# Altium schematic sheet Kick_Sheet.SchDoc
size A4; System: Connector
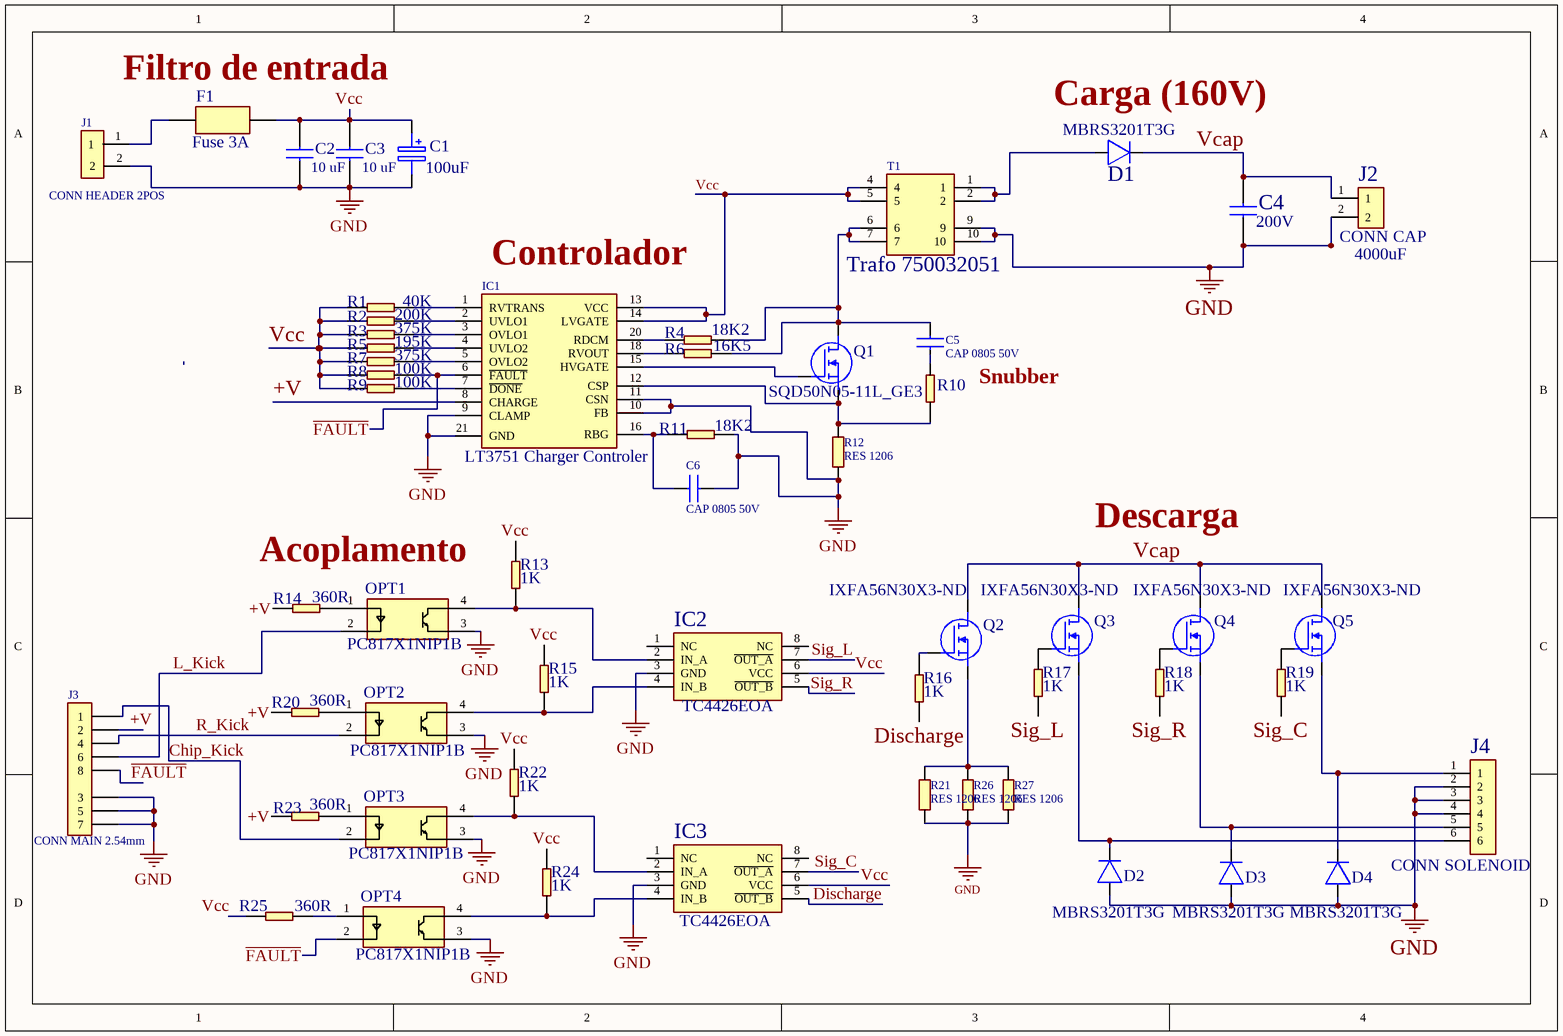
[diagram p0: Kick_Sheet.SchDoc]

## Parts
C1  100uF  [CAPAE830X1050N]
C2  10 uF  [CAPCER1206]
C3  10 uF  [CAPCER1206]
C4  200V  [CAP OUT 2225]
C5  CAP 0805 50V  [CAP0805 50v]
C6  CAP 0805 50V  [CAP0805 50v]
D1  MBRS3201T3G  [DIODE MBRS3201T]
D2  MBRS3201T3G  [DIODE MBRS3201T]
D3  MBRS3201T3G  [DIODE MBRS3201T]
D4  MBRS3201T3G  [DIODE MBRS3201T]
F1  Fuse 3A  [Fuse 3A 63V]
IC1  LT3751 Charger Controler  [LT3751 Charger Controler]
IC2  TC4426EOA  [SOIC127_TC4426]
IC3  TC4426EOA  [SOIC127_TC4426]
J1  CONN HEADER 2POS  [Battery Reto Connector]
J2  CONN CAP  Capacitancia: 4000uF  [CONN CAP]
J3  CONN MAIN 2.54mm  [CONN MAIN 2.54mm]
J4  CONN SOLENOID  [CONN SOLENOID]
OPT1  PC817X1NIP1B  [SOP254_Opto_PC817]
OPT2  PC817X1NIP1B  [SOP254_Opto_PC817]
OPT3  PC817X1NIP1B  [SOP254_Opto_PC817]
OPT4  PC817X1NIP1B  [SOP254_Opto_PC817]
Q1  Manufacturer_Part_Number: SQD50N05-11L_GE3  [Mosfet Chaveamento]  (hidden comment: Mosfet N 50V 50A)
Q2  Manufacturer_Part_Number: IXFA56N30X3-ND  [Mosfet Disparo 2]  (hidden comment: Mosfet N Disparo)
Q3  Manufacturer_Part_Number: IXFA56N30X3-ND  [Mosfet Disparo 2]  (hidden comment: Mosfet N Disparo)
Q4  Manufacturer_Part_Number: IXFA56N30X3-ND  [Mosfet Disparo 2]  (hidden comment: Mosfet N Disparo)
Q5  Manufacturer_Part_Number: IXFA56N30X3-ND  [Mosfet Disparo 2]  (hidden comment: Mosfet N Disparo)
R1  40K  [RES 0805]
R2  200K  [RES 0805]
R3  375K  [RES 0805]
R4  18K2  [RES 0805]
R5  195K  [RES 0805]
R6  16K5  [RES 0805]
R7  375K  [RES 0805]
R8  100K  [RES 0805]
R9  100K  [RES 0805]
R10  (no value)  [RES 0805]
R11  18K2  [RES 0805]
R12  RES 1206  [Res 1206]
R13  1K  [RES 0805]
R14  360R  [RES 0805]
R15  1K  [RES 0805]
R16  1K  [RES 0805]
R17  1K  [RES 0805]
R18  1K  [RES 0805]
R19  1K  [RES 0805]
R20  360R  [RES 0805]
R21  RES 1206  [Res 1206]
R22  1K  [RES 0805]
R23  360R  [RES 0805]
R24  1K  [RES 0805]
R25  360R  [RES 0805]
R26  RES 1206  [Res 1206]
R27  RES 1206  [Res 1206]
T1  Trafo 750032051  [Trafo Flyback]

## Nets
GND: C1.2(-) C2.1 C3.1 C4.1 C6.1 D2.2(A) D3.2(A) D4.2(A) IC1.9(CLAMP) IC1.10(FB) IC1.11(CSN) IC1.21(GND) IC2.3(GND) IC3.3(GND) J1.2 J2.2 J3.3 J3.5 J3.7 J4.2 J4.3 J4.4 OPT1.3(EMITTER) OPT2.3(EMITTER) OPT3.3(EMITTER) OPT4.3(EMITTER) R11.2 R12.2 R21.1 R26.1 R27.1 T1.9 T1.10
+V: IC1.8(CHARGE) J3.2 R14.1 R20.1 R23.1
Chip_Kick: J3.1 OPT3.2(CATHODE)
Discharge: IC3.5(~{OUT_B}) R16.1
~{FAULT}: IC1.6(~{FAULT}) J3.8 OPT4.2(CATHODE) R8.2
L_Kick: J3.6 OPT1.2(CATHODE)
R_Kick: J3.4 OPT2.2(CATHODE)
Sig_C: IC3.7(~{OUT_A}) R19.1
Sig_L: IC2.7(~{OUT_A}) R17.1
Sig_R: IC2.5(~{OUT_B}) R18.1
Vcap: C4.2 D1.1(K) J2.1 Q2.2(D) Q3.2(D) Q4.2(D) Q5.2(D)
Vcc: C1.1(+) C2.2 C3.2 F1.2 IC1.13(VCC) IC1.14(LVGATE) IC2.6(VCC) IC3.6(VCC) R1.1 R2.1 R3.1 R5.1 R7.1 R8.1 R9.1 R13.2 R15.2 R22.2 R24.2 R25.1 T1.4 T1.5
NetC5_1: C5.1 R10.2
NetC5_2: C5.2 Q1.2(D) R4.2 R6.2 T1.6 T1.7
NetC6_2: C6.2 IC1.16(RBG) R11.1
NetD1_2: D1.2(A) T1.1 T1.2
NetD2_1: D2.1(K) J4.6 Q3.3(S)
NetD3_1: D3.1(K) J4.5 Q4.3(S)
NetD4_1: D4.1(K) J4.1 Q5.3(S)
NetF1_1: F1.1 J1.1
NetIC1_1: IC1.1(RVTRANS) R1.2
NetIC1_2: IC1.2(UVLO1) R2.2
NetIC1_3: IC1.3(OVLO1) R3.2
NetIC1_4: IC1.4(UVLO2) R5.2
NetIC1_5: IC1.5(OVLO2) R7.2
NetIC1_7: IC1.7(~{DONE}) R9.2
NetIC1_12: IC1.12(CSP) Q1.3(S) R10.1 R12.1
NetIC1_15: IC1.15(HVGATE) Q1.1(G)
NetIC1_18: IC1.18(RVOUT) R6.1
NetIC1_20: IC1.20(RDCM) R4.1
NetIC2_2: IC2.2(IN_A) OPT1.4(COLLECTOR) R13.1
NetIC2_4: IC2.4(IN_B) OPT2.4(COLLECTOR) R15.1
NetIC3_2: IC3.2(IN_A) OPT3.4(COLLECTOR) R22.1
NetIC3_4: IC3.4(IN_B) OPT4.4(COLLECTOR) R24.1
NetOPT1_1: OPT1.1(ANODE) R14.2
NetOPT2_1: OPT2.1(ANODE) R20.2
NetOPT3_1: OPT3.1(ANODE) R23.2
NetOPT4_1: OPT4.1(ANODE) R25.2
NetQ2_1: Q2.1(G) R16.2
NetQ2_3: Q2.3(S) R21.2 R26.2 R27.2
NetQ3_1: Q3.1(G) R17.2
NetQ4_1: Q4.1(G) R18.2
NetQ5_1: Q5.1(G) R19.2

Not connected (* = marked no-connect by the designer): IC1 17(NC) 19(NC); IC2 1(NC) 8(NC); IC3 1(NC) 8(NC); T1 3 8

## Notes on the sheet
- Filtro de entrada
- (near D1) Carga (160V)
- (near IC1) Controlador
- Snubber
- Acoplamento
- Descarga

## Library data of the parts
C1 = CAP ALUM 100UF 20% 50V SMD: 100µF 50V Aluminum Electrolytic Capacitors Radial, Can - SMD 5000 Hrs @ 105°C / UCD1H101MNL1GS / 493-6388-6-ND; Manufacturer_Name: Nichicon; Allied_Number: 70409359; Datasheet Link: http://www.nichicon.co.jp/english/products/pdfs/e-ucd.pdf; Height: 10.5mm; Manufacturer_Part_Number: UCD1H101MNL1GS; Mouser Part Number: 647-UCD1H101MNL1GS; Mouser Price/Stock: https://www.mouser.com/Search/Refine.aspx?Keyword=647-UCD1H101MNL1GS; RS Part Number: 7151372P; RS Price/Stock: http://uk.rs-online.com/web/p/products/7151372P; Allied Price/Stock: https://www.alliedelec.com/nichicon-ucd1h101mnl1gs/70409359/
C2 C3 = CAP CER 1206: Capacitor C3216C0G1H103J060AA; Manufacturer_Name: TDK; Datasheet Link: https://product.tdk.com/info/en/catalog/datasheets/mlcc_commercial_midvoltage_en.pdf; Height: 0.75mm; Manufacturer_Part_Number: C3216C0G1H103J060AA; Mouser Part Number: 810-C3216C0G1H103J-1; Mouser Price/Stock: https://www.mouser.com/Search/Refine.aspx?Keyword=810-C3216C0G1H103J-1; RS Part Number: 7407467P; RS Price/Stock: http://uk.rs-online.com/web/p/products/7407467P
C4 = CAP OUT 2225: Capacitor / CAP CER 1UF 200V X7R 2225 / 720-1136-1-ND / VJ2225Y105KXCAT; Manufacturer_Name: AVX; Manufacturer_Part_Number: 2225HC103KAZ1A; Datasheet Link: http://datasheets.avx.com/HV-FlexitermMLCC.pdf; Height: 3.4mm; Mouser Part Number: 581-2225HC103KAZ1A; Mouser Price/Stock: https://www.mouser.com/Search/Refine.aspx?Keyword=581-2225HC103KAZ1A
C5 C6 = CAP 0805 50V: Capacitor / 08055A101JAT2A; Manufacturer_Name: AVX; Allied_Number: 70474488; Datasheet Link: https://componentsearchengine.com/Datasheets/1/06031A100FAT2A.pdf; Height: 0.94mm; Manufacturer_Part_Number: 08055A101JAT2A; Mouser Part Number: 581-08055A101J; Mouser Price/Stock: https://www.mouser.com/Search/Refine.aspx?Keyword=581-08055A101J; RS Part Number: 1243222; RS Price/Stock: https://uk.rs-online.com/web/p/products/1243222; Allied Price/Stock: https://www.alliedelec.com/avx-08055a101jat2a/70474488/
D1-D4 = DIODE MBRS3201T3G: Diode / MBRS3201T3G; Manufacturer_Name: ON Semiconductor; Allied_Number: 70339717; Datasheet Link: http://www.onsemi.com/pub/Collateral/MBRS3201T3-D.PDF; Height: 2.56mm; Manufacturer_Part_Number: MBRS3201T3G; Mouser Part Number: 863-MBRS3201T3G; Mouser Price/Stock: https://www.mouser.com/Search/Refine.aspx?Keyword=863-MBRS3201T3G; RS Part Number: 7925640P; RS Price/Stock: http://uk.rs-online.com/web/p/products/7925640P; Allied Price/Stock: http://www.alliedelec.com/on-semiconductor-mbrs3201t3g/70339717/
F1 = Fuse 3A 63V: Fuse / FUSE 3.0A 63VAC/DC SLOW 1206 / 507-1896-1-ND / 0685T3000-01; Manufacturer_Name: LITTELFUSE; Manufacturer_Part_Number: 0466001.NRHF; Datasheet Link: http://www.mouser.com/datasheet/2/240/Littelfuse_Fuse_466_Datasheet.pdf-1317335.pdf; Height: 0.66mm; Mouser Part Number: 576-0466001.NRHF; Mouser Price/Stock: https://www.mouser.com/Search/Refine.aspx?Keyword=576-0466001.NRHF
IC1 = LT3751 Charger Controler: Integrated Circuit; Manufacturer_Name: Linear Technology; Manufacturer_Part_Number: LT3751EFEPBF
IC2 IC3 = TC4426EOA: Integrated Circuit; Manufacturer_Name: Microchip; Allied_Number: 70046935; Datasheet Link: http://ww1.microchip.com/downloads/en/DeviceDoc/20001422G.pdf; Height: 1.75mm; Manufacturer_Part_Number: TC4426EOA; Mouser Part Number: 579-TC4426EOA; Mouser Price/Stock: https://www.mouser.com/Search/Refine.aspx?Keyword=579-TC4426EOA; RS Part Number: 6684345; RS Price/Stock: https://uk.rs-online.com/web/p/products/6684345; Allied Price/Stock: https://www.alliedelec.com/microchiptechnologyinc-tc4426eoa/70046935/
J1 = Battery Connector: CONN HEADER R/A 2POS 2.54MM / 22-05-3021 / WM4300-ND; Manufacturer_Name: Molex; Allied_Number: 70190620; Datasheet Link: http://www.molex.com/webdocs/datasheets/pdf/en-us/0022053031_PCB_HEADERS.pdf; Manufacturer_Part_Number: 22-05-3021; Mouser Part Number: 538-22-05-3021; Mouser Price/Stock: https://www.mouser.com/Search/Refine.aspx?Keyword=538-22-05-3021; RS Part Number: 6795448; RS Price/Stock: https://uk.rs-online.com/web/p/products/6795448; Allied Price/Stock: https://www.alliedelec.com/molex-incorporated-22-05-3021/70190620/; System: Connector
J2 = CONN CAP: Connector / CONN HEADER VERT 2POS 3.96MM / 0009652028 / WM18823-ND; Manufacturer_Name: Molex; Allied_Number: 70374002; Datasheet Link: https://www.molex.com/webdocs/datasheets/pdf/en-us/0009652028_PCB_HEADERS.pdf; Height: 14.25mm; Manufacturer_Part_Number: 09-65-2028; Mouser Part Number: 538-09-65-2028; Mouser Price/Stock: https://www.mouser.com/Search/Refine.aspx?Keyword=538-09-65-2028; RS Part Number: 6705237P; RS Price/Stock: http://uk.rs-online.com/web/p/products/6705237P; Allied Price/Stock: https://www.alliedelec.com/molex-incorporated-09-65-2028/70374002/
J3 = CONN MAIN 2.54mm: Connector / CONN HEADER VERT 8POS 2.54MM / M20-9980445 / 952-2122-ND; Manufacturer_Name: FCI; Manufacturer_Part_Number: 20021311-00010T4LF; Datasheet Link: http://portal.fciconnect.com/Comergent//fci/drawing/20021311.pdf; Height: 4.6mm; Mouser Part Number: 649-221311-00010T4LF; Mouser Price/Stock: https://www.mouser.com/Search/Refine.aspx?Keyword=649-221311-00010T4LF; System: Connector
J4 = CONN SOLENOID: Connector / CONN HEADER VERT 6POS 3.96MM / 0026604060 / WM4624-ND; Manufacturer_Name: TE Connectivity; Manufacturer_Part_Number: 640445-6; Allied_Number: 70083693; Datasheet Link: http://www.te.com/commerce/DocumentDelivery/DDEController?Action=srchrtrv&DocNm=640445&DocType=Customer+Drawing&DocLang=English; Height: 11.049mm; Mouser Part Number: 571-6404456; Mouser Price/Stock: https://www.mouser.com/Search/Refine.aspx?Keyword=571-6404456; RS Part Number: 1789596P; RS Price/Stock: http://uk.rs-online.com/web/p/products/1789596P; Allied Price/Stock: https://www.alliedelec.com/te-connectivity-640445-6/70083693/
OPT1-OPT4 = PC817X1NIP1B: Integrated Circuit; Manufacturer_Name: Sharp Microelectronics; Datasheet Link: https://cdn.sharpsde.com/fileadmin/products/Optoelectronics/Isolation%20Devices/Specs%20Photocoupler/PC817XxNIP1B_12Oct16_Spec_ED-16P011.pdf; Height: 4.2mm; Manufacturer_Part_Number: PC817X1NIP1B; Mouser Part Number: 852-PC817X1NIP1B; Mouser Price/Stock: https://www.mouser.com/Search/Refine.aspx?Keyword=852-PC817X1NIP1B
Q1 = Mosfet Chaveamento: MOSFET (N-Channel) / N-Channel 50V 50A (Tc) 75W (Tc) Surface Mount TO-252AA / SQD50N05-11L_GE3 / SQD50N05-11L_GE3CT-ND; Manufacturer_Name: Alpha & Omega Semiconductors; Datasheet Link: http://aosmd.com/res/data_sheets/AOD4189.pdf; Height: 2mm
Q2-Q5 = Mosfet N Disparo: MOSFET (N-Channel) / N-Channel 300V 56A (Tc) 320W (Tc) Surface Mount TO-263AA / IXFA56N30X3-ND / 300V/56A ULTRA JUNCTION X3-CLASS; Manufacturer_Name: ON Semiconductor; Datasheet Link: https://www.onsemi.com/pub/Collateral/BBS3002-D.PDF; Height: 4.83mm; Mouser Price/Stock: https://www.mouser.com/Search/Refine.aspx?Keyword=863-BBS3002-TL-1E
R1-R11 R13-R20 R22-R24 = Resistor 0805: Manufacturer_Name: TE Connectivity; Manufacturer_Part_Number: CPF0805B105RE1; Datasheet Link: http://docs-europe.electrocomponents.com/webdocs/13d1/0900766b813d116f.pdf; Height: 0.65mm; Mouser Part Number: 279-CPF0805B105RE1; Mouser Price/Stock: https://www.mouser.com/Search/Refine.aspx?Keyword=279-CPF0805B105RE1; RS Part Number: 1239398; RS Price/Stock: http://uk.rs-online.com/web/p/products/1239398
R12 R21 R26 R27 = RES 1206: Resistor CR1206-FW-1504ELF; Manufacturer_Name: Bourns; Datasheet Link: http://componentsearchengine.com/Datasheets/1/CR1206-FW-1504ELF.pdf; Height: 0.75mm; Manufacturer_Part_Number: CR1206-FW-1504ELF; Mouser Part Number: 652-CR1206FW1504ELF; Mouser Price/Stock: https://www.mouser.com/Search/Refine.aspx?Keyword=652-CR1206FW1504ELF
R25 = Resistor 0805: Resistor; Manufacturer_Name: TE Connectivity; Manufacturer_Part_Number: CPF0805B105RE1; Datasheet Link: http://docs-europe.electrocomponents.com/webdocs/13d1/0900766b813d116f.pdf; Height: 0.65mm; Mouser Part Number: 279-CPF0805B105RE1; Mouser Price/Stock: https://www.mouser.com/Search/Refine.aspx?Keyword=279-CPF0805B105RE1; RS Part Number: 1239398; RS Price/Stock: http://uk.rs-online.com/web/p/products/1239398
T1 = Trafo 750032051: Transformer; Manufacturer_Name: Wurth Elektronik; Manufacturer_Part_Number: 750032051; Mouser Part Number: N/A; Mouser Price/Stock: https://www.mouser.com/Search/Refine.aspx?Keyword=N%2FA